# Altium schematic sheet 03_ SoC GPIOs Connection.SchDoc
size 420 x 297 mm; SheetNumber: 3; SheetTotal: 4
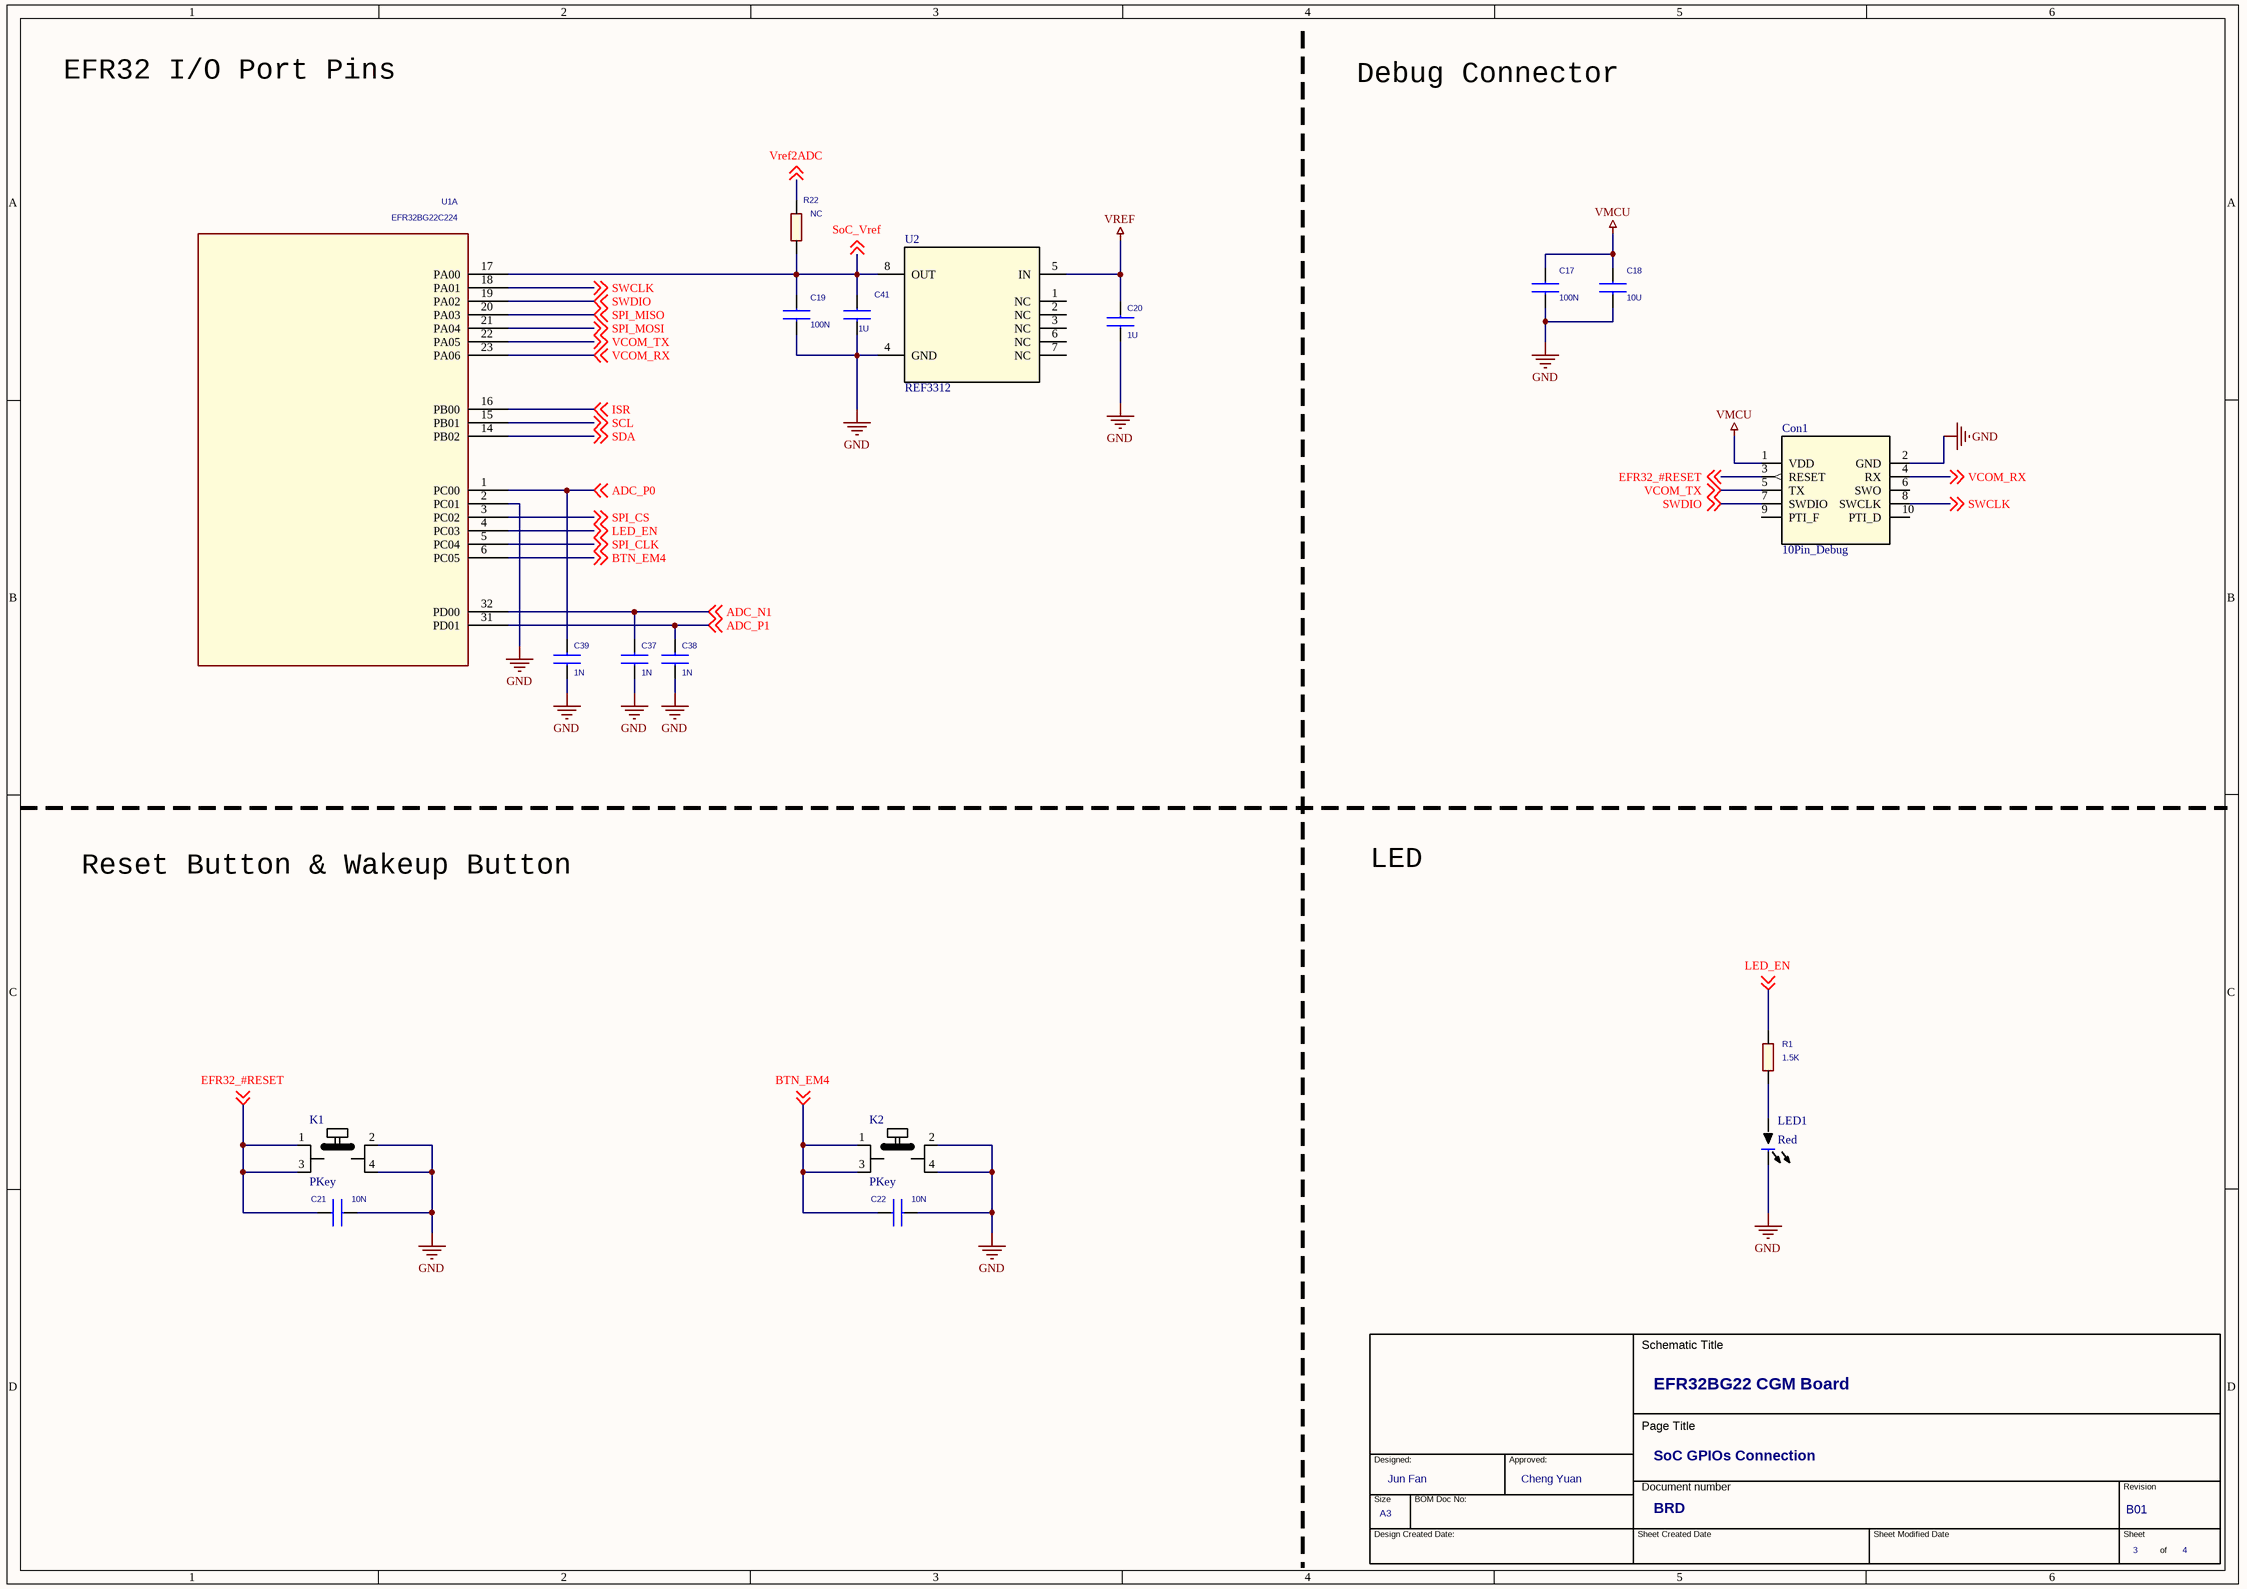
[diagram p0: 03_ SoC GPIOs Connection.SchDoc]

## Parts
*?  OrgAddr2: Cheng Yuan  OrgAddr1: Jun Fan  Page Count: 4  Page Number: 3  Doc: BRD  Title: EFR32BG22 CGM Board  RevCode: B01  Page Size: A3  Page Title: SoC GPIOs Connection  (hidden comment: TitleBlock_SiLabs_A3)  (graphical)
C17  100N  [C0201_L]
C18  10U  [C0603_L]
C19  100N  [C0201_L]
C20  1U  [C0402_L]
C21  10N  [C0201_L]
C22  10N  [C0201_L]
C37  1N  [C0201_L]
C38  1N  [C0201_L]
C39  1N  [C0201_L]
C41  1U  [C0402_L]
Con1  10Pin_Debug  [10Pin_Con]
K1  PKey  [PKey-P]
K2  PKey  [PKey-P]
LED1  LED  [LED_Red]  (value not drawn)
R1  1.5K  [R0402_L]
R22  NC  [R0402_L]
U1  EFR32BG22C224  [QFN32_M040_4.0X4.0_EP_SL]  (part A of 3)
U2  REF3312  [RSE0008A]

## Nets
GND: C17.2 C18.2 C19.2 C20.2 C21.2 C22.2 C37.2 C38.2 C39.2 C41.2 Con1.2(GND) K1.2(SIGNAL) K1.4(SIGNAL) K2.2(SIGNAL) K2.4(SIGNAL) LED1.1(Neg) U1.2(PC01) U2.4(GND)
VMCU: C17.1 C18.1 Con1.1(VDD)
VREF: C20.1 U2.5(IN)
ADC_N1: C37.1 U1.32(PD00) ; off-sheet ADC_N1
ADC_P0: C39.1 U1.1(PC00) ; off-sheet ADC_P0
ADC_P1: C38.1 U1.31(PD01) ; off-sheet ADC_P1
BTN_EM4: C22.1 K2.1(GND1) K2.3(GND4) U1.6(PC05) ; off-sheet BTN_EM4
EFR32_#RESET: C21.1 Con1.3(RESET) K1.1(GND1) K1.3(GND4) ; off-sheet EFR32_#RESET
ISR: U1.16(PB00) ; off-sheet ISR
LED_EN: R1.1 U1.4(PC03) ; off-sheet LED_EN
SCL: U1.15(PB01) ; off-sheet SCL
SDA: U1.14(PB02) ; off-sheet SDA
SoC_Vref: C19.1 C41.1 R22.1 U1.17(PA00) U2.8(OUT) ; off-sheet SoC_Vref
SPI_CLK: U1.5(PC04) ; off-sheet SPI_CLK
SPI_CS: U1.3(PC02) ; off-sheet SPI_CS
SPI_MISO: U1.20(PA03) ; off-sheet SPI_MISO
SPI_MOSI: U1.21(PA04) ; off-sheet SPI_MOSI
SWCLK: Con1.8(SWCLK) U1.18(PA01) ; off-sheet SWCLK
SWDIO: Con1.7(SWDIO) U1.19(PA02) ; off-sheet SWDIO
VCOM_RX: Con1.4(RX) U1.23(PA06) ; off-sheet VCOM_RX
VCOM_TX: Con1.5(TX) U1.22(PA05) ; off-sheet VCOM_TX
Vref2ADC: R22.2 ; off-sheet Vref2ADC
NetLED1_2: LED1.2(Positive) R1.2

Not connected (* = marked no-connect by the designer): Con1 6(SWO) 9(PTI_F) 10(PTI_D); U2 1(NC) 2(NC) 3(NC) 6(NC) 7(NC)

## Notes on the sheet
- EFR32 I/O Port Pins
- Debug Connector
- Reset Button & Wakeup Button
- LED
- (in symbol LED_P) Red
- (in symbol TitleBlock_SiLabs_A3) Schematic Title; Page Title; Designed:; Approved:; Document number; Revision; Size; BOM Doc No:; Design Created Date:; Sheet Created Date; Sheet Modified Date; Sheet; of

## Library data of the parts
*? = TitleBlock_SiLabs_A3: Cage Code: <Cage Code>
C17 C19-C22 C41 = C0201: Rating: 25V; Tolerance: 10%; Technology: X5R
C18 = C0603: Rating: 25V; Tolerance: 20%; Technology: X5R
C37-C39 = C0201: Rating: 10V; Tolerance: 10%; Technology: X5R
LED1 = LED_P: Mfg: Wurth Electronics; Mfg #: 150060YS75000
R1 R22 = RESISTOR: Tolerance: 5%; Price_1K: 0.005
U1 = EFR32xG22_QFN32_2G4: MFG: Silicon Labs; MFG #: EFR32BG22C224F512IM32
U2 = REF3312AIRSET: No Description Available; PartNumber: REF3312AIRSER; Mfg: Texas Instruments; RefDes: RefDes; Type: DEV; Mfg #: REF3312AIRSET; Copyright: Copyright (C) 2018 Accelerated Designs. All rights reserved